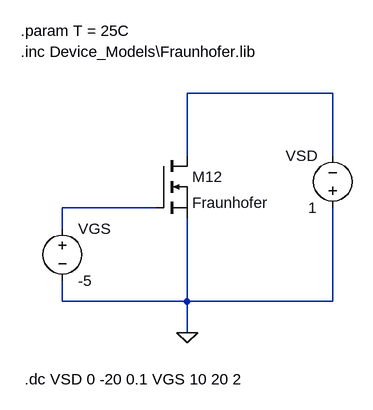
[diagram p0: schematic fwd_curves.asc]
fwd_curves.asc, the LTspice schematic file:
Version 4
SHEET 1 4496 1000
WIRE -352 -224 -576 -224
WIRE -576 -128 -576 -224
WIRE -352 -128 -352 -224
WIRE -624 -48 -768 -48
WIRE -768 -16 -768 -48
WIRE -768 96 -768 64
WIRE -576 96 -576 -32
WIRE -576 96 -768 96
WIRE -352 96 -352 -48
WIRE -352 96 -576 96
WIRE -576 144 -576 96
FLAG -576 144 0
SYMBOL nmos -624 -128 R0
SYMATTR InstName M12
SYMATTR Value Fraunhofer
SYMATTR Prefix X
SYMBOL voltage -768 -32 R0
WINDOW 123 0 0 Left 0
WINDOW 39 0 0 Left 0
SYMATTR InstName VGS
SYMATTR Value -5
SYMBOL voltage -352 -32 R180
WINDOW 0 24 96 Left 2
WINDOW 3 24 16 Left 2
SYMATTR InstName VSD
SYMATTR Value 1
TEXT -832 -320 Left 2 !.param T = 25C
TEXT -832 -288 Left 2 !.inc Device_Models\\Fraunhofer.lib
TEXT -826 216 Left 2 !.dc VSD 0 -20 0.1 VGS 10 20 2

The netlist it stands for:
* fwd_curves.asc
XM12 N001 N002 0 Fraunhofer  ; pins D G S
VGS N002 0 -5
VSD 0 N001 1
.param T = 25C
.inc Device_Models\Fraunhofer.lib
.dc VSD 0 -20 0.1 VGS 10 20 2
.backanno
.end